# EAGLE design FlyballETS-PWR (EAGLE 7.5.0)
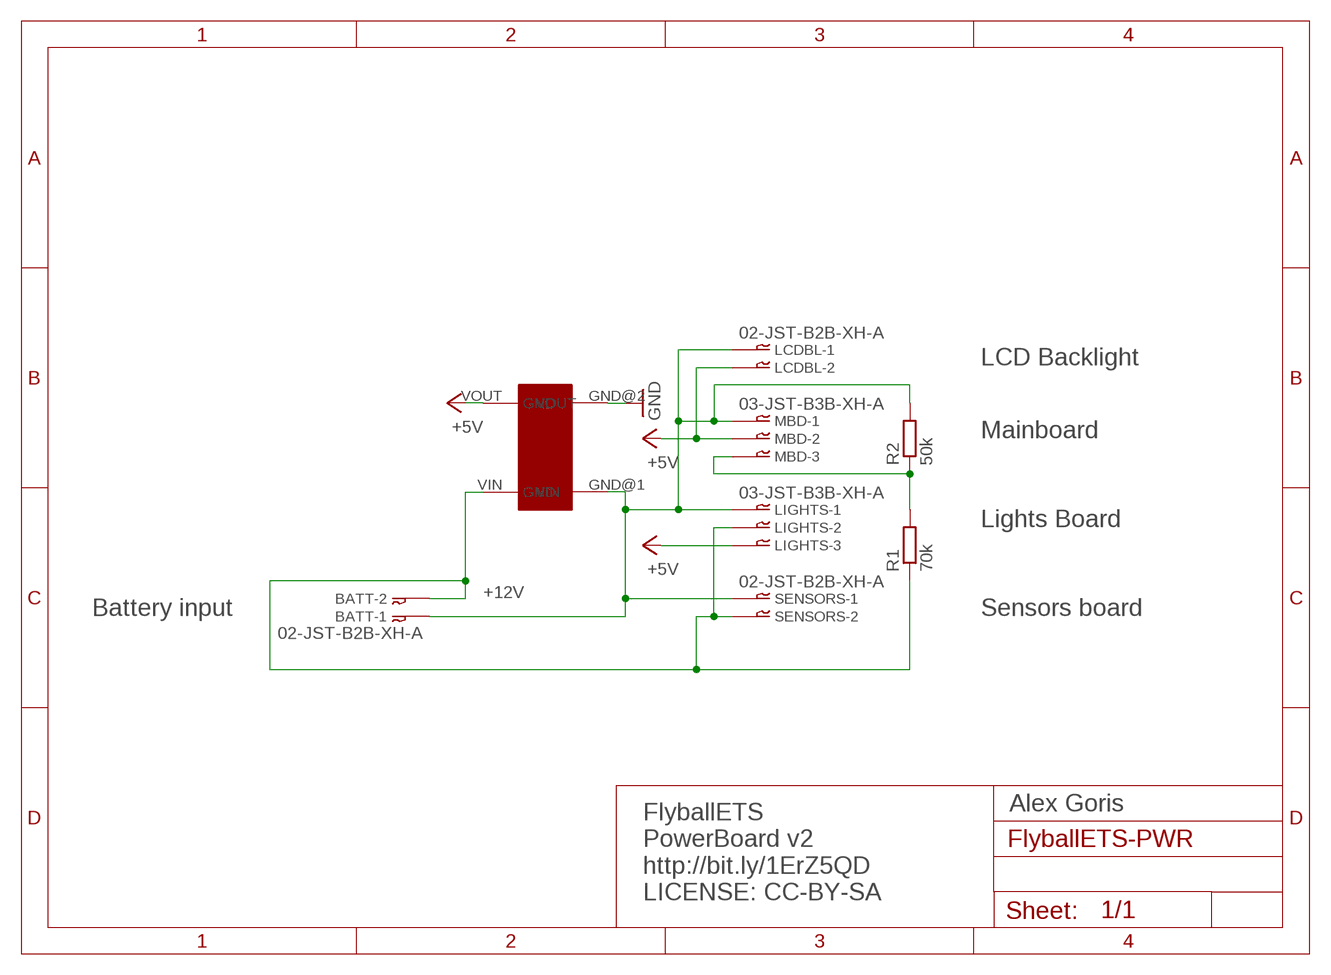
[diagram p0: schematic, sheet 1]

## Parts
BATT  02-JST-B2B-XH-A  [B2B-XH]
LCDBL  02-JST-B2B-XH-A  [B2B-XH]
LIGHTS  03-JST-B3B-XH-A  [B3B-XH]
MBD  03-JST-B3B-XH-A  [B3B-XH]
R1  70k  R-EU_0207/10  [0207/10]
R2  50k  R-EU_0207/10  [0207/10]
SENSORS  02-JST-B2B-XH-A  [B2B-XH]
U$1  LM2596-BOARD  [LM2596-BOARD]

## Nets
+5V: LCDBL.P$2 LIGHTS.P$3 MBD.P$2 U$1.VOUT
+12V: BATT.P$2 LIGHTS.P$2 R1.1 SENSORS.P$2 U$1.VIN
GND: BATT.P$1 LCDBL.P$1 LIGHTS.P$1 MBD.P$1 R2.2 SENSORS.P$1 U$1.GND@1(GND) U$1.GND@2(GND)
N$1: MBD.P$3 R1.2 R2.1

## Notes on the sheet
- LCD Backlight
- Mainboard
- Lights Board
- Battery input | Sensors board
- Alex Goris
- FlyballETS
  PowerBoard v2
  http://bit.ly/1ErZ5QD
  LICENSE: CC-BY-SA

## Library data of the parts
BATT LCDBL SENSORS = bt_con-jst-xh:02-JST: JST CONNECTOR
LIGHTS MBD = bt_con-jst-xh:03-JST: JST CONNECTOR
R1 R2 = resistor:R-EU_: RESISTOR, European symbol
U$1 = _custom:LM2596-BOARD

## Board
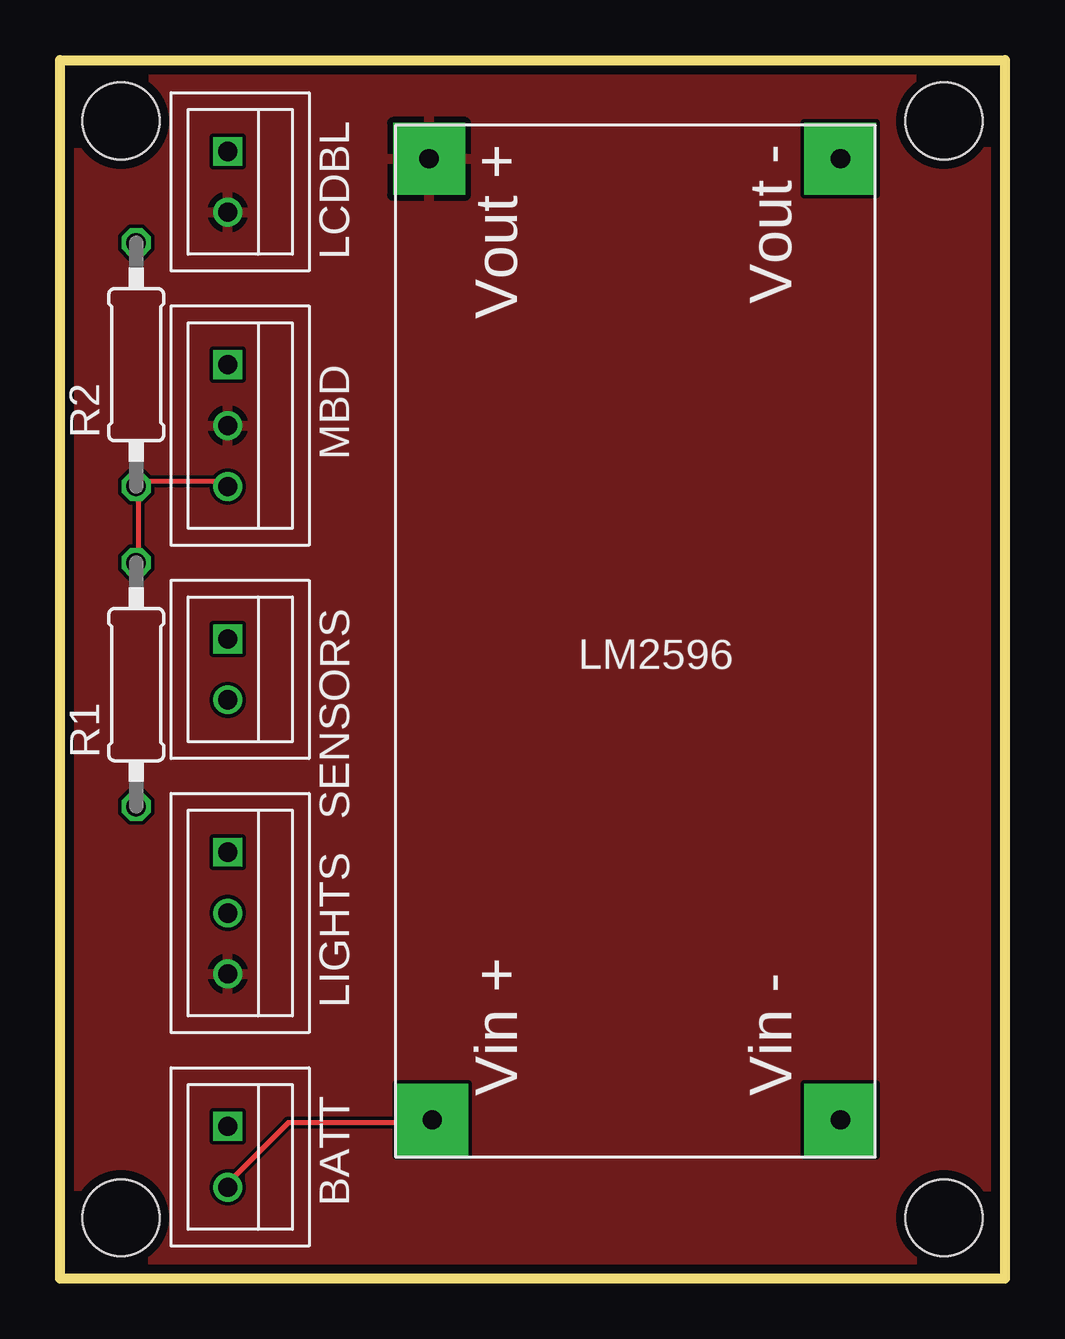
[diagram p1: board, top side]
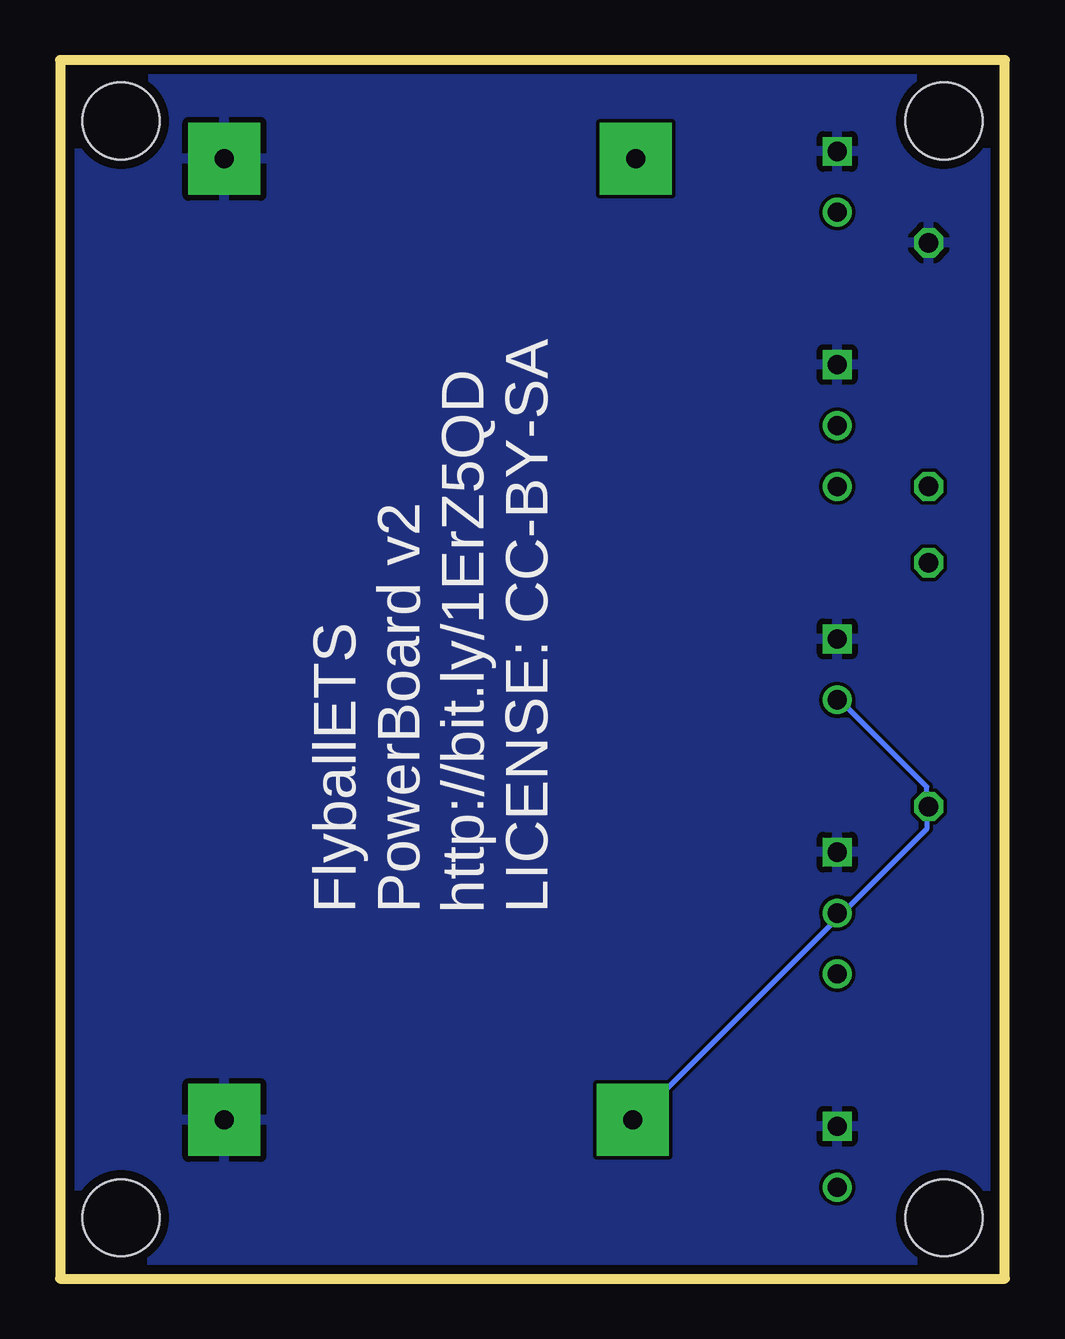
[diagram p2: board, bottom side, seen from below]

Size 39.37 x 50.8 mm. Coordinates in mm from the lower left corner, seen from the top.
Outline: 0,0 0,50.8 39.37,50.8 39.37,0 0,0
Copper layers (1*16): Top 0.0356mm / dielectric 1.5011mm / Bottom 0.0356mm
Design rules "LaenPCBOrder": minimum track width 6mil, minimum drill 13mil, track to track 6mil, track to pad 6mil, pad to pad 6mil, via to via 6mil, smd to smd 6mil, copper to edge 15mil, drill to drill 6mil, minimum pad ring 7mil, minimum via ring 7mil, stop-mask expansion 3mil, vias tented up to drill 0mil, thermal gap 10mil
Holes 3.2 mm at 2.54,2.54 2.54,48.26 36.83,48.26 36.83,2.54

### Footprints (pad centres in the part's own frame; a part is rotated, then mirrored left to right if it is on the bottom)
B2B-XH = drill 0.8 square: P$1 -2.54,0 | drill 0.8: P$2 0,0
B3B-XH = drill 0.8 square: P$1 -2.54,0 | drill 0.8: P$2 0,0; P$3 2.54,0
0207/10 = drill 0.813 octagon: 1 -5.08,0; 2 5.08,0
LM2596-BOARD = drill 0.8 pad 3 square: GND@1 18.55,1.54; GND@2 18.55,41.6; VIN 1.54,1.54; VOUT 1.405,41.6

### Placement (x,y rotation side)
BATT  6.99,3.81 270 top
LCDBL  6.99,44.45 270 top
LIGHTS  6.99,15.24 270 top
MBD  6.99,35.56 270 top
R1  3.17,24.77 90 top
R2  3.17,38.1 90 top
SENSORS  6.99,24.13 270 top
U$1  13.97,5.08 0 top
U$2  [A5L-LOC]  -63.5,-48.26 0 top  (outside the outline)

### Tracks (layer width: path | path; a pad name or v marks a point on that pad's centre or on a via)
+5V
  pour Top: 0,50.8 39.37,50.8 39.37,0 0,0
+12V
  Top 0.203: BATT.P$2 7,4 9.5,6.5 15.5,6.5 U$1.VIN
  Bottom 0.203: SENSORS.P$2 6.75,24 3.25,20.5 3.25,19.75 R1.1 3.25,19.5 3.25,18.75 6.75,15.25 LIGHTS.P$2 7,15 15.5,6.5 U$1.VIN
GND
  pour Bottom: 0,50.8 39.37,50.8 39.37,0 0,0
N$1
  Top 0.203: MBD.P$3 6.75,33.25 3.25,33.25 R2.1 3.25,33 3.25,30 R1.2

### Text on the board
tPlace: Vout - | Vout + | Vin + | Vin -
bPlace: FlyballETS / PowerBoard v2 / http://bit.ly/1ErZ5QD / LICENSE: CC-BY-SA
Document: Alex Goris | FlyballETS / PowerBoard v2 / http://bit.ly/1ErZ5QD / LICENSE: CC-BY-SA